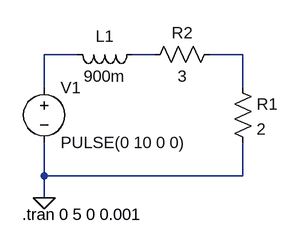
[diagram p0: schematic ResistorInSeriesAndInductance.asc]
ResistorInSeriesAndInductance.asc, the LTspice schematic file:
Version 4
SHEET 1 880 680
WIRE 112 0 64 0
WIRE 224 0 192 0
WIRE 352 0 304 0
WIRE 64 48 64 0
WIRE 352 48 352 0
WIRE 64 176 64 128
WIRE 352 176 352 128
WIRE 352 176 64 176
WIRE 64 208 64 176
FLAG 64 208 0
SYMBOL res 336 32 R0
SYMATTR InstName R1
SYMATTR Value 2
SYMBOL res 320 -16 R90
WINDOW 0 0 56 VBottom 2
WINDOW 3 32 56 VTop 2
SYMATTR InstName R2
SYMATTR Value 3
SYMBOL voltage 64 32 R0
WINDOW 123 0 0 Left 0
WINDOW 39 0 0 Left 0
SYMATTR InstName V1
SYMATTR Value PULSE(0 10 0 0)
SYMBOL ind 208 -16 R90
WINDOW 0 5 56 VBottom 2
WINDOW 3 32 56 VTop 2
SYMATTR InstName L1
SYMATTR Value 900m
TEXT 32 232 Left 2 !.tran 0 5 0 0.001

The netlist it stands for:
* ResistorInSeriesAndInductance.asc
R1 N003 0 2
R2 N003 N002 3
V1 N001 0 PULSE(0 10 0 0)
L1 N002 N001 900m
.tran 0 5 0 0.001
.backanno
.end